# EAGLE design Awesome-Shield-0.5 (EAGLE 7.2.0)
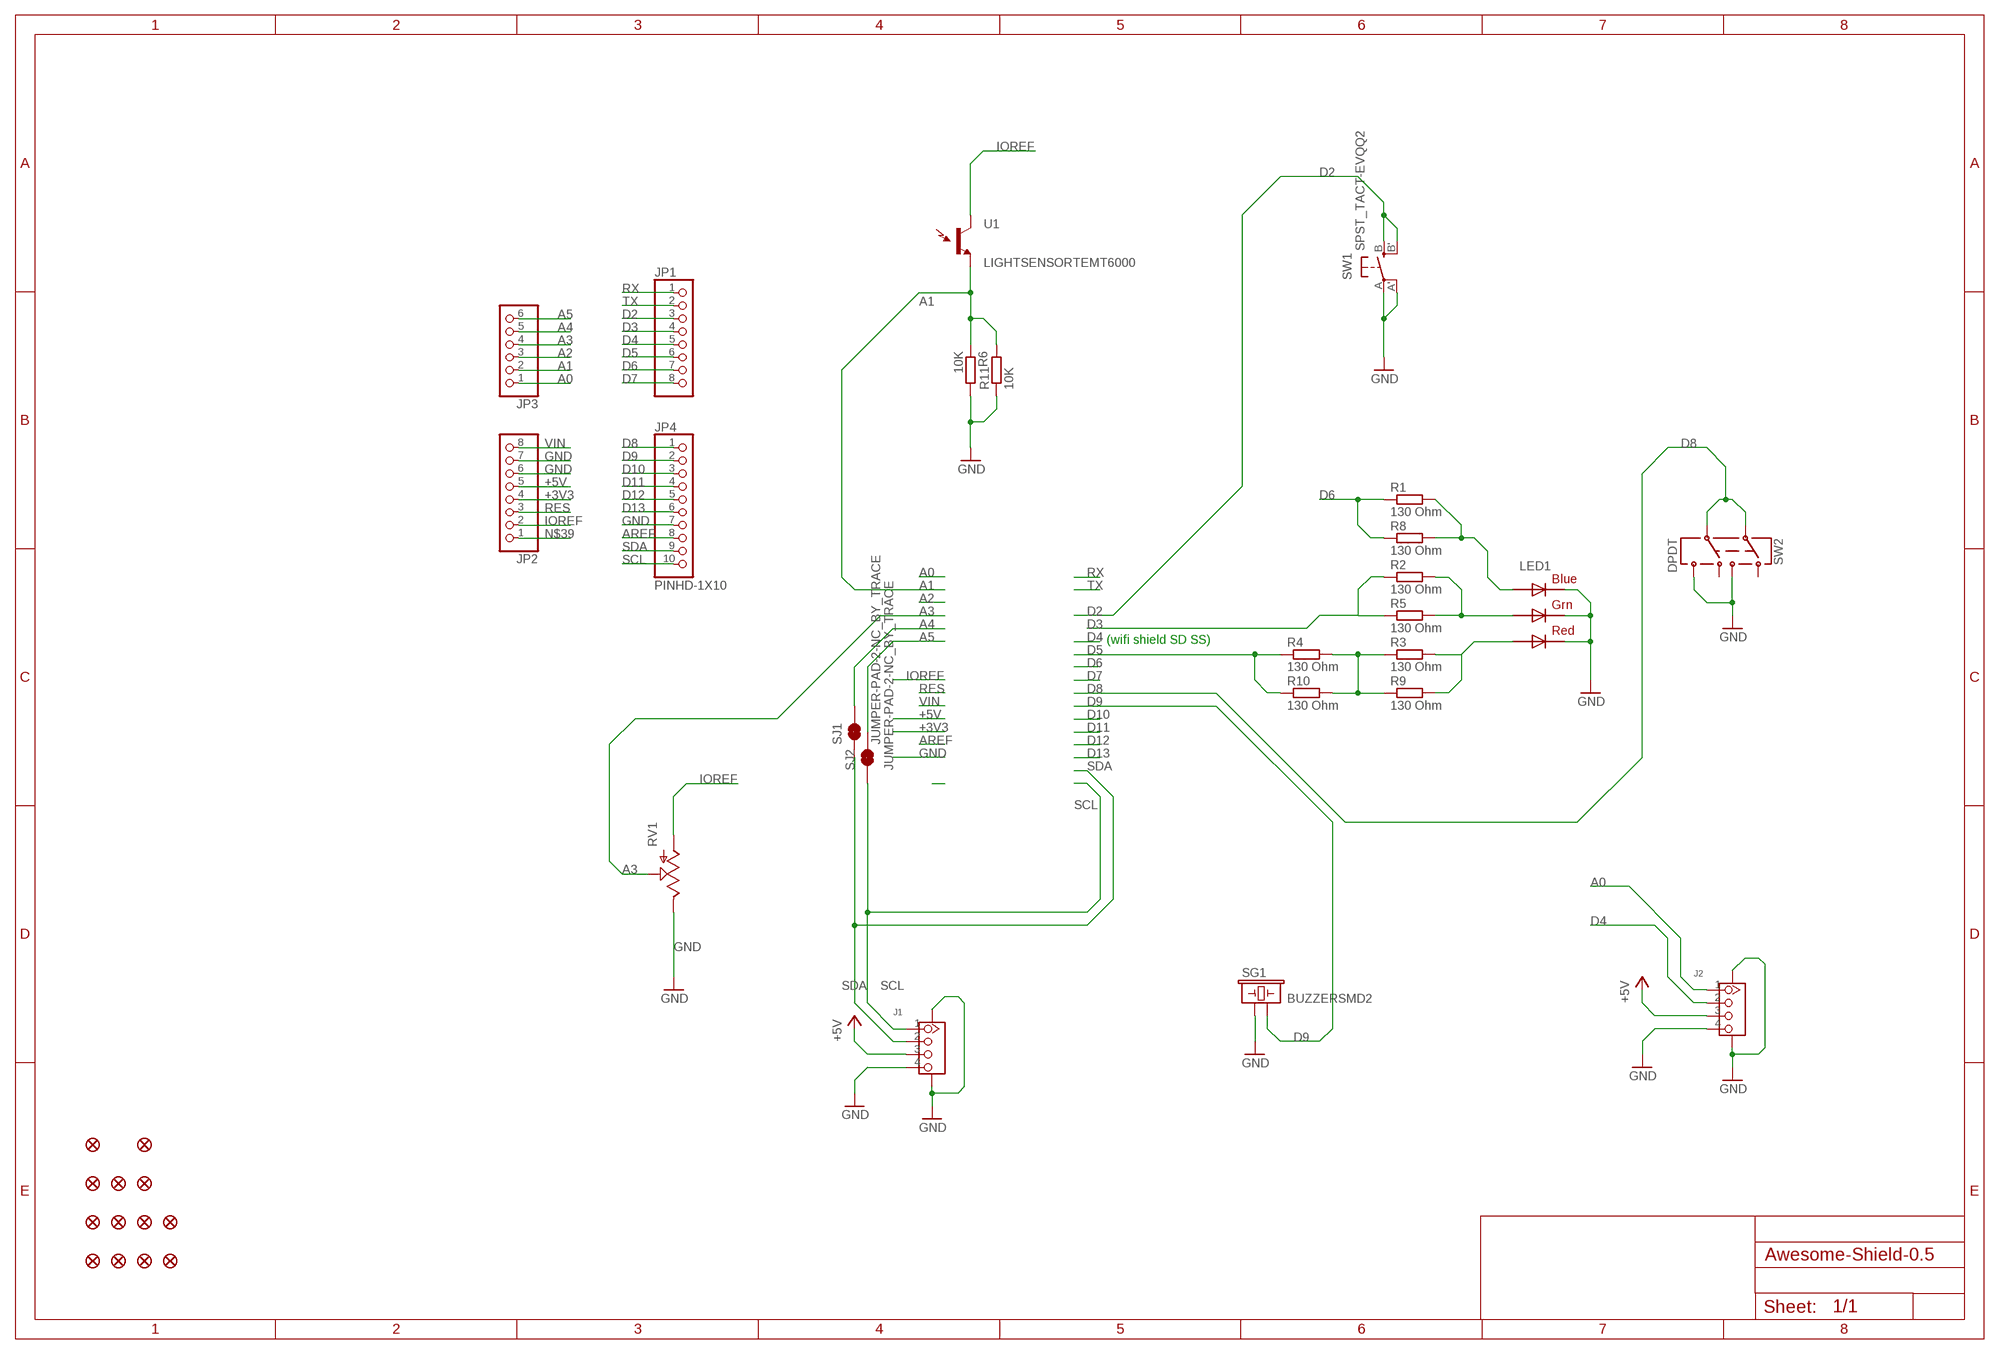
[diagram p0: schematic, sheet 1]

## Parts
FID1  FIDUCIAL1X2  [FIDUCIAL-1X2]
FID2  FIDUCIAL1X2  [FIDUCIAL-1X2]
FID3  FIDUCIAL1X2  [FIDUCIAL-1X2]
FID4  FIDUCIAL1X2  [FIDUCIAL-1X2]
FID5  FIDUCIALUFIDUCIAL  [MICRO-FIDUCIAL]
FID6  FIDUCIALUFIDUCIAL  [MICRO-FIDUCIAL]
FID7  FIDUCIALUFIDUCIAL  [MICRO-FIDUCIAL]
FID8  FIDUCIALUFIDUCIAL  [MICRO-FIDUCIAL]
FID9  FIDUCIALUFIDUCIAL  [MICRO-FIDUCIAL]
FID10  FIDUCIALUFIDUCIAL  [MICRO-FIDUCIAL]
FID11  FIDUCIALUFIDUCIAL  [MICRO-FIDUCIAL]
FID13  FIDUCIALUFIDUCIAL  [MICRO-FIDUCIAL]
FID15  FIDUCIALUFIDUCIAL  [MICRO-FIDUCIAL]
J1  GROVE-CONNECTOR-SMD(4+2P-2.0)  [HW4-SMD-2.0]
J2  GROVE-CONNECTOR-SMD(4+2P-2.0)  [HW4-SMD-2.0]
JP1  PINHD-1X8CLEANBIG  [1X08-CLEANBIG]
JP2  PINHD-1X8CLEANBIG  [1X08-CLEANBIG]
JP3  PINHD-1X6CLEAN  [1X06-CLEAN]
JP4  PINHD-1X10  [1X10-BIG]
LED1  RGBLED5050  [RGBLED5050]
R1  130 Ohm  R-EU_R1206  [R1206]
R2  130 Ohm  R-EU_R1206  [R1206]
R3  130 Ohm  R-EU_R1206  [R1206]
R4  130 Ohm  R-EU_R1206  [R1206]
R5  130 Ohm  R-EU_R0603  [R0603]
R6  10K  R-EU_R1206  [R1206]
R8  130 Ohm  R-EU_R0603  [R0603]
R9  130 Ohm  R-EU_R0603  [R0603]
R10  130 Ohm  R-EU_R0603  [R0603]
R11  10K  R-EU_R0603  [R0603]
RV1  POT  [ALPS_POT]
SG1  BUZZERSMD2  [BUZZER-CCV]
SJ1  JUMPER-PAD-2-NC_BY_TRACE  [PAD-JUMPER-2-NC_BY_TRACE_YES_SILK]
SJ2  JUMPER-PAD-2-NC_BY_TRACE  [PAD-JUMPER-2-NC_BY_TRACE_YES_SILK]
SW1  SPST_TACT-EVQQ2  [EVQ-Q2]
SW2  DPDT  SWITCH-DPDTAYZ0202  [AYZ0202]
U1  LIGHTSENSORTEMT6000  [TEMT6000-SEN]

## Nets
+3V3: JP2.4
+5V: J1.3 J2.3 JP2.5
A0: J2.1 JP3.1
A1: JP3.2 R6.1 R11.2 U1.EMITTER(E1)
A2: JP3.3
A3: JP3.4 RV1.P$2(S)
A4: JP3.5 SJ1.2
A5: JP3.6 SJ2.2
AREF: JP4.8
D2: JP1.3 SW1.B'(S1) SW1.B(S)
D3: JP1.4 R2.1 R5.1
D4: J2.2 JP1.5
D5: JP1.6 R4.1 R10.1
D6: JP1.7 R1.1 R8.1
D7: JP1.8
D8: JP4.1 SW2.2 SW2.5
D9: JP4.2 SG1.-
D10: JP4.3
D11: JP4.4
D12: JP4.5
D13: JP4.6
GND: J1.4 J1.SS1 J1.SS2 J2.4 J2.SS1 J2.SS2 JP2.6 JP2.7 JP4.7 LED1.4(BLUE_C) LED1.5(RED_C) LED1.6(GREEN_C) R6.2 R11.1 RV1.P$1(E) SG1.+ SW1.A'(P1) SW1.A(P) SW2.3 SW2.6
IOREF: JP2.2 RV1.P$3(A) U1.COLLECTOR(C1)
N$2: R3.1 R4.2 R9.1 R10.2
N$3: LED1.2(RED_A) R3.2 R9.2
N$8: LED1.3(BLUE_A) R1.2 R8.2
N$9: LED1.1(GREEN_A) R2.2 R5.2
N$39: JP2.1
RES: JP2.3
RX: JP1.1
SCL: J1.1 JP4.10 SJ2.1
SDA: J1.2 JP4.9 SJ1.1
TX: JP1.2
VIN: JP2.8
Unconnected: SW2.1 SW2.4

## Notes on the sheet
- (wifi shield SD SS)

## Library data of the parts
FID1-FID11 FID13 FID15 = SparkFun-Aesthetics:FIDUCIAL: Fiducial Alignment Points Various fiducial points for machine vision alignment.
J1 J2 = Seeed-OPL-Connector:GROVE-CONNECTOR-SMD(4+2P-2.0): 320110030
JP1 JP2 = adafruit:PINHD-1X8: PIN HEADER
JP3 = adafruit:PINHD-1X6: PIN HEADER
JP4 = adafruit:PINHD-1X10: Pin header 1x10 0.1" spacing With round pins
LED1 = adafruit:RGBLED: For 5050 RGB LEDs, the order of the LEDs may vary from one manufacturer to another!
R1-R6 R8-R11 = rcl:R-EU_: RESISTOR, European symbol
RV1 = SparkFun-Electromechanical:POT; PROD_ID: RES-09177
SG1 = SparkFun-Electromechanical:BUZZER: Buzzer 12mm Spark Fun Electronics SKU : Comp-Buzzer
SJ1 SJ2 = SparkFun-Passives:JUMPER-PAD-2-NC_BY_TRACE
SW1 = adafruit:SPST_TACT: SMT 6mm switch, EVQQ2 series http://www.ladyada.net/library/eagle
SW2 = SparkFun-Electromechanical:SWITCH-DPDT: DPDT Version of the COM-00597; PROD_ID: SWCH-08179
U1 = SparkFun-Sensors:LIGHTSENSOR: Ambient Light Sensor Simple light detection sensor. Output varies with light intensity input. Spark Fun Electronics SKU : COM-08348

## Net classes
0 default: width 0.203 mm, drill 0.305 mm, clearance 0.152 mm

## Board
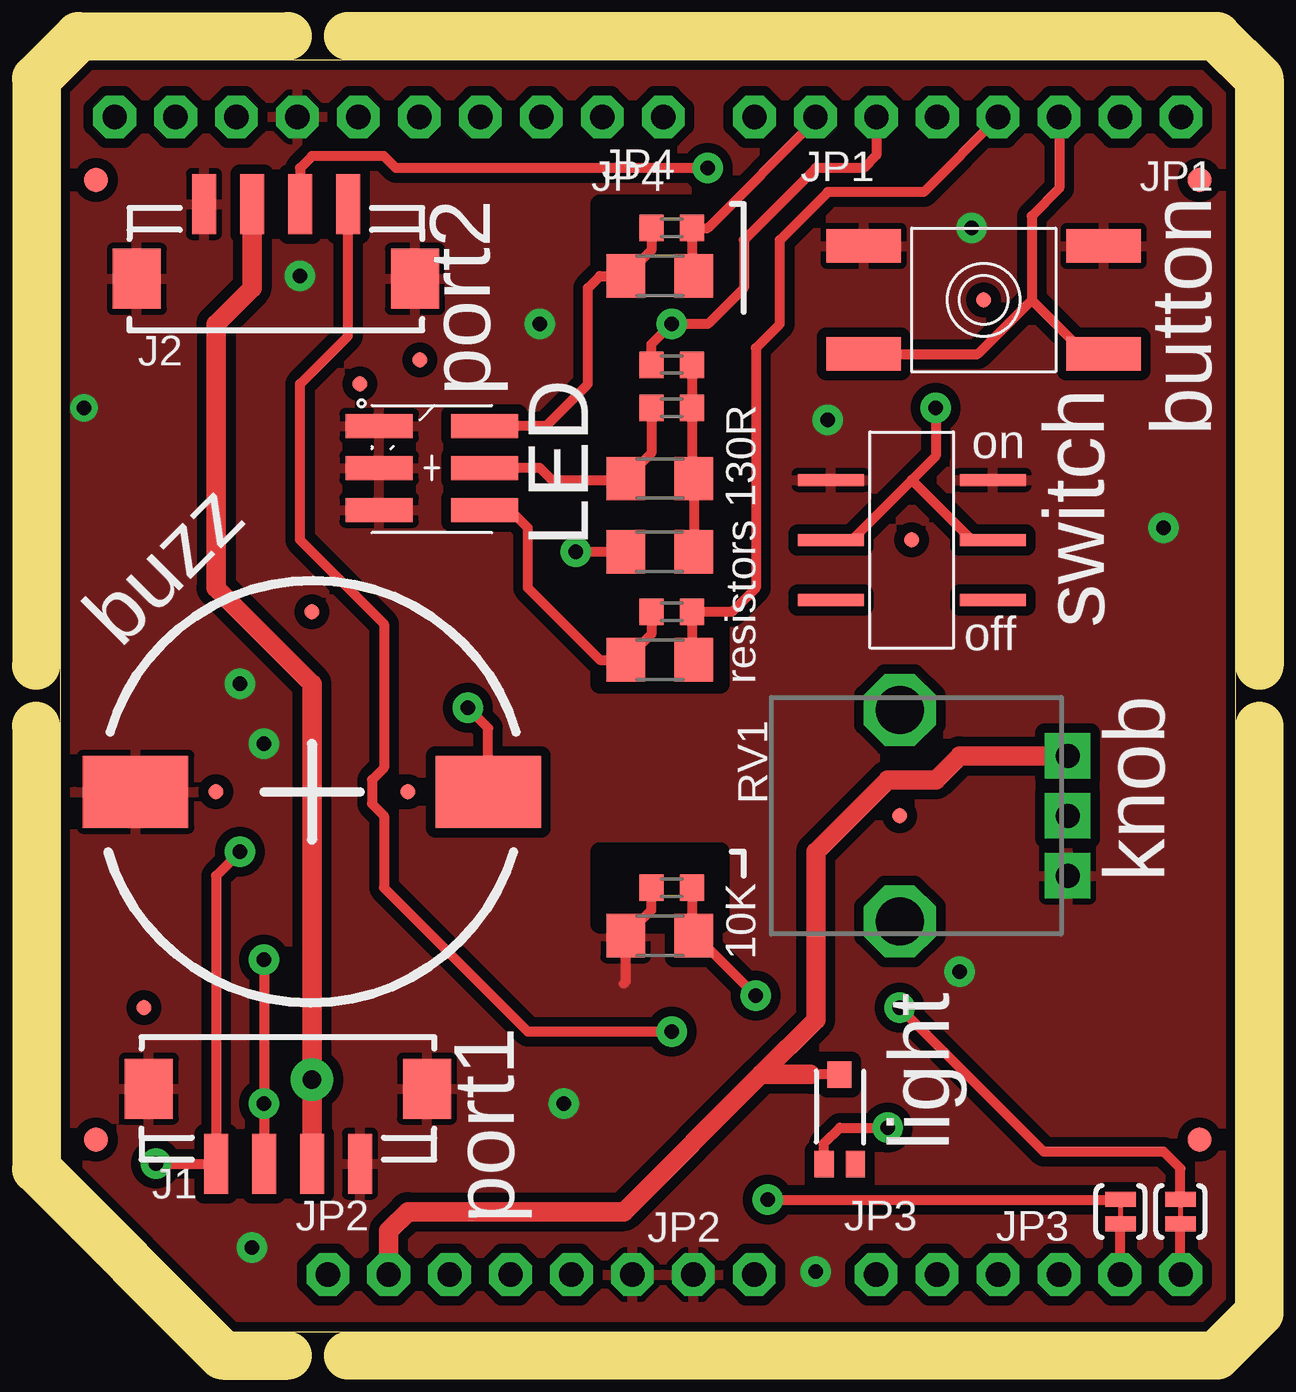
[diagram p1: board, top side]
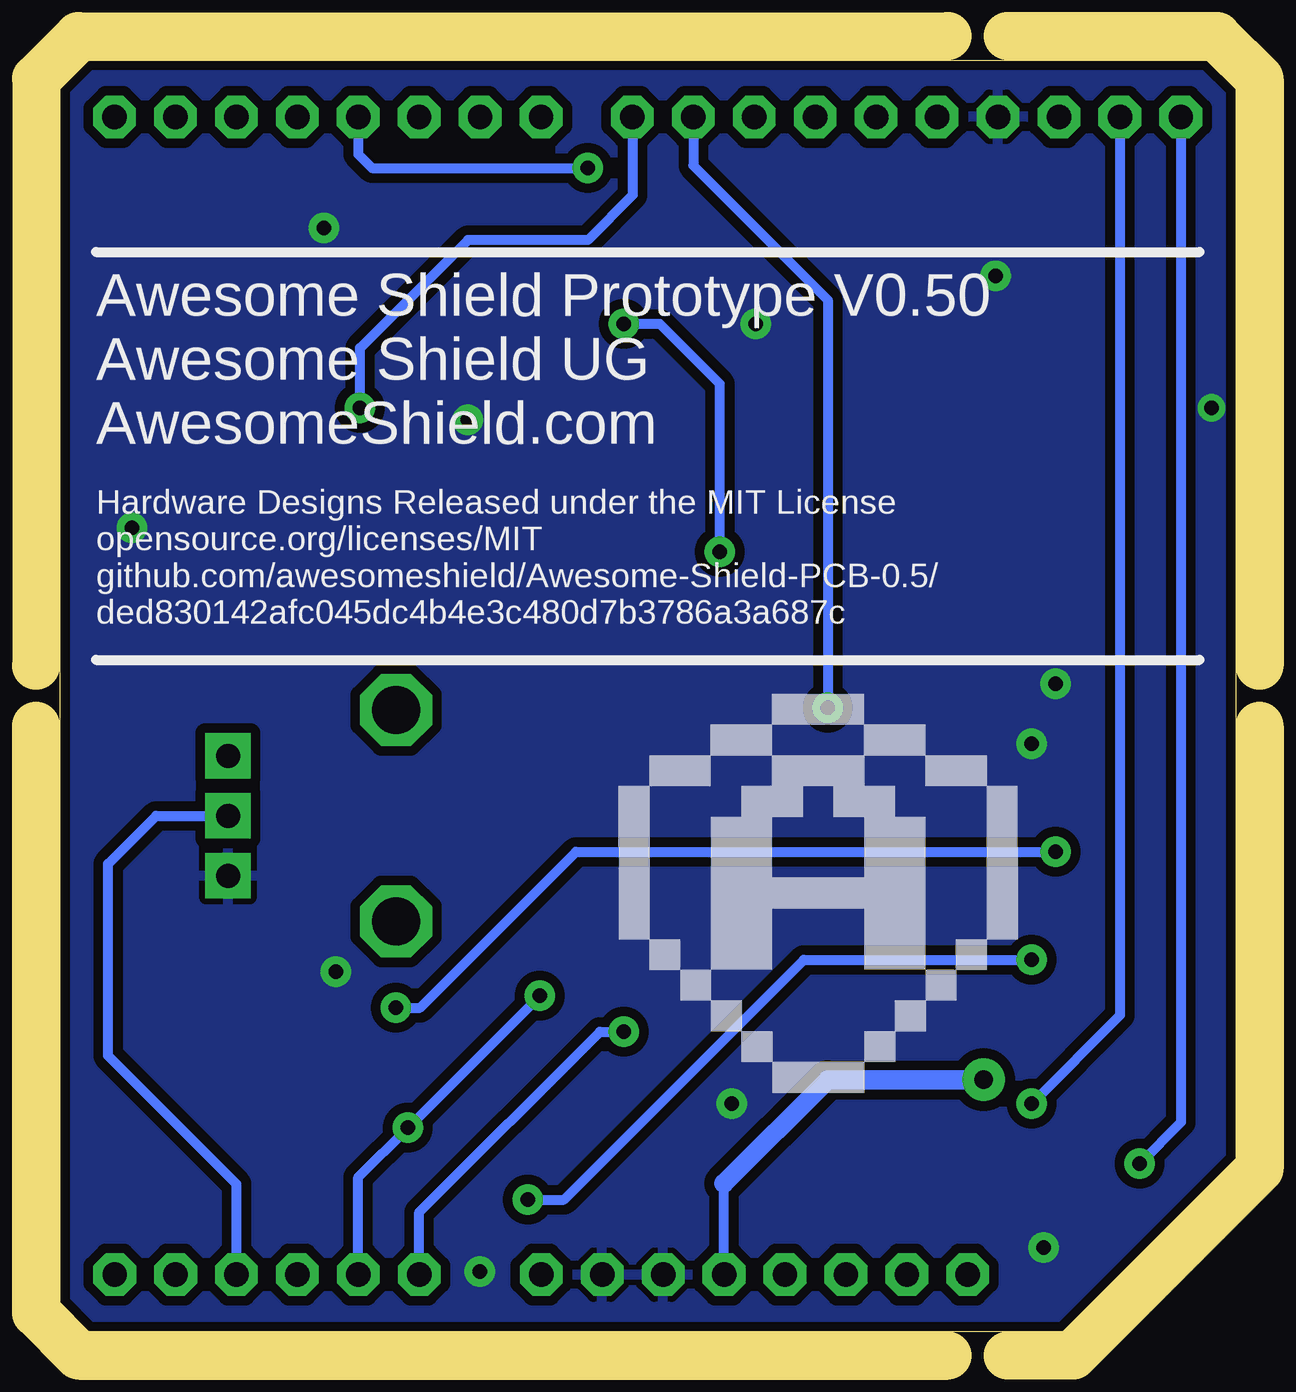
[diagram p2: board, bottom side, seen from below]

Size 49 x 53 mm. Coordinates in mm from the lower left corner, seen from the top.
Outline: 1.2,53 0,51.8 0,7.2 7.2,0 47.8,0 49,1.2 49,51.8 47.8,53 1.2,53
Copper layers (1*16): Top 0.035mm / dielectric 1.5mm / Bottom 0.035mm
Design rules "SeeedStudio_2layer_DRU_no_angle_20140221": minimum track width 6mil, minimum drill 12mil, track to track 6mil, track to pad 6mil, pad to pad 6mil, via to via 6mil, smd to smd 0mil, copper to edge 10mil, drill to drill 10mil, minimum pad ring 10mil, minimum via ring 6mil, stop-mask expansion 2mil, vias tented up to drill 100mil, thermal gap 10mil
tRestrict: area 22.5,27 to 27.5,47; area 22.5,17 to 27.5,20
Milling: 12 lines

### Footprints (pad centres in the part's own frame; a part is rotated, then mirrored left to right if it is on the bottom)
FIDUCIAL-1X2 = smd 1 x 1: 1 0,0
MICRO-FIDUCIAL = smd 0.635 x 0.635: 1 0,0
HW4-SMD-2.0 = smd 1 x 2.5: 1 -3,0; 2 -1,0; 3 1,0; 4 3,0 | smd 2 x 2.5: SS1 -5.8,3.123; SS2 5.8,3.123
1X08-CLEANBIG = drill 1.016 pad 1.778 octagon: 1 -8.89,0; 2 -6.35,0; 3 -3.81,0; 4 -1.27,0; 5 1.27,0; 6 3.81,0; 7 6.35,0; 8 8.89,0
1X06-CLEAN = drill 1.016 pad 1.778 octagon: 1 -6.35,0; 2 -3.81,0; 3 -1.27,0; 4 1.27,0; 5 3.81,0; 6 6.35,0
1X10-BIG = drill 1.016 pad 1.778 octagon: 1 -11.43,0; 2 -8.89,0; 3 -6.35,0; 4 -3.81,0; 5 -1.27,0; 6 1.27,0; 7 3.81,0; 8 6.35,0; 9 8.89,0; 10 11.43,0
RGBLED5050 = smd 2.8 x 1: 1 -2.2,1.75; 2 -2.2,0; 3 -2.2,-1.75; 4 2.2,-1.75; 5 2.2,0; 6 2.2,1.75
R1206 = smd 1.6 x 1.803: 1 -1.422,0; 2 1.422,0
R0603 = smd 1 x 1.1: 1 -0.85,0; 2 0.85,0
ALPS_POT = drill 1 pad 1.88 square: P$1 7,-2.5; P$2 7,0; P$3 7,2.5 | drill 2 octagon: P$4 0,-4.4; P$5 0,4.4
BUZZER-CCV = smd 4.4 x 3: + 7.35,0; - -7.35,0
PAD-JUMPER-2-NC_BY_TRACE_YES_SILK = smd 0.635 x 1.27: 1 -0.508,0; 2 0.508,0
EVQ-Q2 = smd 3.1 x 1.4: A -5,-2.25; A' 5,-2.25; B -5,2.25; B' 5,2.25
AYZ0202 = smd 0.5 x 2.75: 1 -2.5,3.375; 2 0,3.375; 3 2.5,3.375; 4 -2.5,-3.375; 5 0,-3.375; 6 2.5,-3.375
TEMT6000-SEN = smd 1.1 x 0.8: BASE -1.87,-0.65; EMITTER -1.87,0.65 | smd 1.1 x 1: COLLECTOR 1.86,0.01

### Placement (x,y rotation side)
FID1  1.5,8 0 top
FID2  47.5,48 0 top
FID3  47.5,8 0 top
FID4  1.5,48 0 top
FID5  3.5,13.5 0 top
FID6  12.5,39.5 0 top
FID7  38.5,43 0 top
FID8  14.5,22.5 0 top
FID9  10.5,30 0 top
FID10  6.5,22.5 0 top
FID11  35,21.5 0 top
FID13  35.5,33 0 top
FID15  15,40.5 0 top
J1  9.5,7 0 top
J2  9,47 180 top
JP1  37.84,50.63 180 top
JP2  20.05,2.37 0 top
JP3  40.37,2.37 0 top
JP4  13.71,50.63 180 top
LED1  15.5,36 180 top
R1  25,44 180 top
R2  25,28 180 top
R3  25,35.55 180 top
R4  25,32.5 0 top
R5  25.5,30 180 top
R6  25,16.5 180 top
R8  25.5,46 180 top
R9  25.5,38.5 180 top
R10  25.5,40.3 0 top
R11  25.5,18.5 0 top
RV1  35,21.5 0 top
SG1  10.5,22.5 180 top
SJ1  44.2,5 270 top
SJ2  46.7,5 270 top
SW1  38.5,43 180 top
SW2  35.5,33 90 top
U1  32.5,8.85 90 top

### Tracks (layer width: path | path; a pad name or v marks a point on that pad's centre or on a via)
+5V  (via drill 0.76 pad 1.78)
  Top 0.813: J1.3 v10.5,10.5 10.5,27 6.5,31 6.5,42 8,43.5 J2.3
  Bottom 0.406: JP2.5 21.32,6.17
  Bottom 0.813: 21.32,6.17 17,10.5 v10.5,10.5
A0  (via drill 0.6 pad 1.27)
  Top 0.406: J2.1 12,41.5 10,39.5 10,33 13.5,29.5 13.5,23.5 13,23 13,22 13.5,21.5 13.5,18.5 19.5,12.5 v25.5,12.5
  Bottom 0.406: v25.5,12.5 26.5,12.5 34.02,4.97 JP3.1
A1  (via drill 0.6 pad 1.27)
  Top 0.406: R11.2 26.35,16.57 R6.1 26.5,16.5 v29,14 | U1.EMITTER 31.85,7.85 32.5,8.5 v34.5,8.5
  Bottom 0.406: v29,14 v34.5,8.5 36.56,6.43 JP3.2
A3
  Bottom 0.406: RV1.P$2 45,21.5 47,19.5 47,11.5 41.65,6.14 JP3.4
A4
  Top 0.406: 44.19,4.48 SJ1.2 44.2,2.37 JP3.5
A5
  Top 0.406: 46.73,4.47 SJ2.2 46.7,2.37 JP3.6
D2
  Top 0.406: 40.5,43 40.5,46.5 41.65,47.65 JP1.3 | 40.5,43 38.25,40.75 SW1.B' | SW1.B 42.75,40.75 40.5,43
D3
  Top 0.406: R2.1 26.35,28.07 R5.1 28,30 29,31 29,41 30,42 30,45.5 32,47.5 36,47.5 39.1,50.6 JP1.4
D4  (via drill 0.6 pad 1.27)
  Top 0.406: v27,48.5 14,48.5 13.5,49 10.5,49 10,48.5 J2.2
  Bottom 0.406: v27,48.5 36,48.5 36.57,49.07 JP1.5
D5  (via drill 0.6 pad 1.27)
  Top 0.406: R4.1 v21.5,32.5 | R10.1 24.65,41.15 v25.5,42 27,42 28.5,43.5 28.5,45.5 31.5,48.5 33.5,48.5 34.03,49.03 JP1.6
  Bottom 0.406: v21.5,32.5 21.5,39.5 24,42 v25.5,42
D6
  Top 0.406: R1.1 26.35,44.07 R8.1 27,46 31.48,50.48 JP1.7
D8  (via drill 0.6 pad 1.27)
  Top 0.406: v36.5,38.5 36.5,36.5 35.5,35.5 | 35.5,35.5 33,33 SW2.2 | SW2.5 38,33 35.5,35.5
  Bottom 0.406: v36.5,38.5 36.5,41 32,45.5 27,45.5 25.14,47.37 JP4.1
D9  (via drill 0.6 pad 1.27)
  Top 0.406: SG1.- 17.85,25.15 v17,26
  Bottom 0.406: v17,26 17,43 22.6,48.6 JP4.2
GND  (via drill 0.6 pad 1.15, 0.6 pad 1.27)
  Top 0.406: 23.5,14.5 23.58,14.58 R6.2 24.65,17.57 R11.1
  other vias: 8,3.5 8.5,24.5 20,42 46,33.5 10,44 7.5,27 37.5,15 32,38 38,46 21,9.5 1,38.5 31.5,2.5
  pour Top (isolate 0.406): 47.8,53.1 1.2,53 0,51.8 0,7.2 7.1,0 47.8,0 49,1.3 49.06,4.9 49.06,37.9 49,40.5 49,51.9
  pour Bottom (isolate 0.406): 1.2,53 0,51.8 0,7.2 7.2,0 47.8,0 49.1,1.4 49.06,3.88 49.06,36.88 49,41 49,51.9 47.8,53.1
IOREF
  Top 0.406: U1.COLLECTOR 31.29,10.71
  Top 0.813: 29.21,10.71 23.5,5 14.5,5 13.71,4.21 JP2.2 | 29.21,10.71 31.5,13 31.5,20 34.5,23 36.5,23 37.5,24 RV1.P$3 | 31.29,10.71 29.21,10.71
N$2
  Top 0.406: R4.2 R3.1 26.35,35.62 R9.1 R10.2
N$3
  Top 0.406: R9.2 24.65,36.62 R3.2 23.53,35.5 20.5,35.5 20,36 LED1.2
N$8
  Top 0.406: R8.2 24.65,45.07 R1.2 22.5,44 22,43.5 22,39.5 20.25,37.75 LED1.3
N$9
  Top 0.406: LED1.1 18.75,34.25 19.5,33.5 19.5,31 22.5,28 R2.2 24.65,29.07 R5.2
SCL  (via drill 0.6 pad 1.27)
  Top 0.406: v4,7 J1.1 6.5,19 v7.5,20 | SJ2.1 46.7,6.8 46,7.5 41,7.5 v35,13.5
  Bottom 0.406: v4,7 2.27,8.72 2.28,8.73 JP4.10 | v7.5,20 27.5,20 34,13.5 v35,13.5
SDA  (via drill 0.6 pad 1.27)
  Top 0.406: J1.2 v8.5,9.5 v8.5,15.5 | v29.5,5.5 SJ1.1
  Bottom 0.406: v8.5,9.5 4.82,13.19 JP4.9 | v8.5,15.5 18,15.5 28,5.5 v29.5,5.5

### Text on the board
tPlace: JP4 | JP1 | button | J2 | LED | port2 | switch | on | buzz | off | resistors 130R | knob | RV1 | 10K | light | J1 | port1 | JP2 | JP3
bPlace: Awesome Shield Prototype V0.50 / Awesome Shield UG / AwesomeShield.com | Hardware Designs Released under the MIT License / opensource.org/licenses/MIT / github.com/awesomeshield/Awesome-Shield-PCB-0.5/ / ded830142afc045dc4b4e3c480d7b3786a3a687c